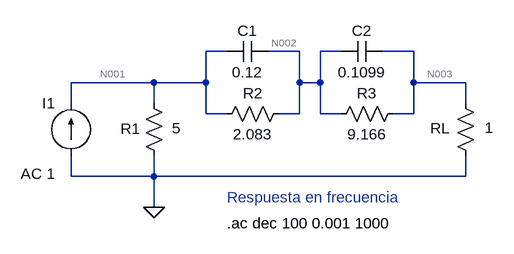
[diagram p0: schematic EJ1.asc]
EJ1.asc, the LTspice schematic file:
Version 4
SHEET 1 1016 680
WIRE 272 112 240 112
WIRE 384 112 336 112
WIRE 448 112 416 112
WIRE 560 112 512 112
WIRE 160 160 32 160
WIRE 240 160 240 112
WIRE 240 160 160 160
WIRE 384 160 384 112
WIRE 416 160 416 112
WIRE 416 160 384 160
WIRE 560 160 560 112
WIRE 640 160 560 160
WIRE 32 192 32 160
WIRE 160 192 160 160
WIRE 640 192 640 160
WIRE 240 208 240 160
WIRE 272 208 240 208
WIRE 384 208 384 160
WIRE 384 208 352 208
WIRE 416 208 416 160
WIRE 448 208 416 208
WIRE 560 208 560 160
WIRE 560 208 528 208
WIRE 32 304 32 272
WIRE 160 304 160 272
WIRE 160 304 32 304
WIRE 640 304 640 272
WIRE 640 304 160 304
WIRE 160 352 160 304
FLAG 160 352 0
SYMBOL current 32 272 R180
WINDOW 0 24 80 Left 2
WINDOW 3 24 0 Left 2
WINDOW 123 24 -28 Left 2
WINDOW 39 0 0 Left 0
SYMATTR InstName I1
SYMATTR Value ""
SYMATTR Value2 AC 1
SYMBOL res 176 288 R180
WINDOW 0 37 57 Left 2
WINDOW 3 -25 58 Left 2
SYMATTR InstName R1
SYMATTR Value 5
SYMBOL res 368 192 R90
WINDOW 0 0 56 VBottom 2
WINDOW 3 32 56 VTop 2
SYMATTR InstName R2
SYMATTR Value 2.083
SYMBOL res 544 192 R90
WINDOW 0 0 56 VBottom 2
WINDOW 3 32 56 VTop 2
SYMATTR InstName R3
SYMATTR Value 9.166
SYMBOL cap 336 96 R90
WINDOW 0 0 32 VBottom 2
WINDOW 3 32 32 VTop 2
SYMATTR InstName C1
SYMATTR Value 0.12
SYMBOL cap 512 96 R90
WINDOW 0 0 32 VBottom 2
WINDOW 3 32 32 VTop 2
SYMATTR InstName C2
SYMATTR Value 0.1099
SYMBOL res 656 288 R180
WINDOW 0 40 58 Left 2
WINDOW 3 -27 59 Left 2
SYMATTR InstName RL
SYMATTR Value 1
TEXT 272 376 Left 2 !.ac dec 100 0.001 1000
TEXT 272 336 Left 2 ;Respuesta en frecuencia

The netlist it stands for:
* EJ1.asc
I1 0 N001 AC 1
R1 0 N001 5
R2 N002 N001 2.083
R3 N003 N002 9.166
C1 N002 N001 0.12
C2 N003 N002 0.1099
RL 0 N003 1
.ac dec 100 0.001 1000
* Respuesta en frecuencia
.backanno
.end

* Results of the author's LTspice run, read from the files saved beside the schematic
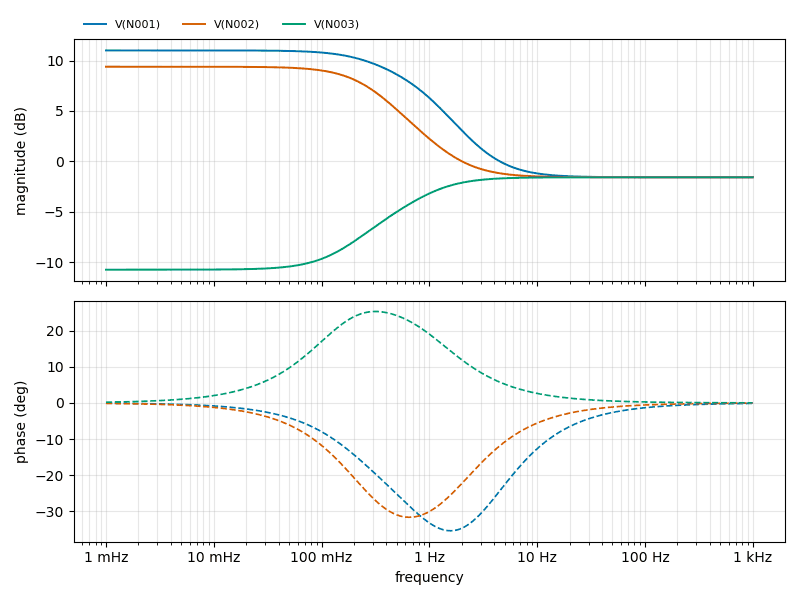
[diagram p1: AC Analysis of EJ1.asc, plotted from the saved traces]
* AC Analysis, 1 run:
*   V(N001): 11.01 dB at 1 mHz, -1.58 dB at 1 kHz, peak 11.01 dB at 1 mHz, 3 dB below the peak at 623 mHz
*   V(N002): 9.39 dB at 1 mHz, -1.58 dB at 1 kHz, peak 9.39 dB at 1 mHz, 3 dB below the peak at 362.9 mHz
*   V(N003): -10.76 dB at 1 mHz, -1.58 dB at 1 kHz, peak -1.58 dB at 1 kHz, 3 dB below the peak at 576.3 mHz